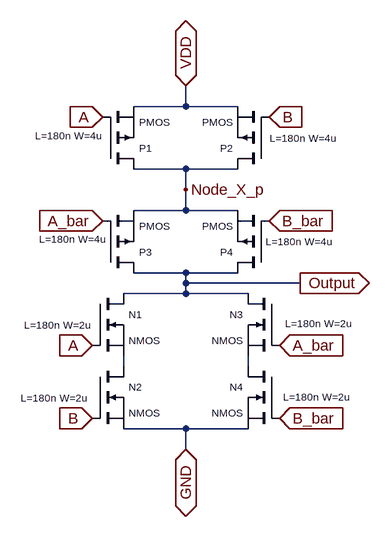
[diagram p0: schematic CMOS_XOR.asc]
CMOS_XOR.asc, the LTspice schematic file:
Version 4.1
SHEET 1 880 680
WIRE 208 -192 208 -224
WIRE 208 -192 128 -192
WIRE 288 -192 208 -192
WIRE 208 -96 128 -96
WIRE 288 -96 208 -96
WIRE 208 -64 208 -96
WIRE 208 -32 208 -64
WIRE 208 -32 128 -32
WIRE 288 -32 208 -32
WIRE 208 64 128 64
WIRE 288 64 208 64
WIRE 208 80 208 64
WIRE 384 80 208 80
WIRE 208 96 208 80
WIRE 208 96 112 96
WIRE 304 96 208 96
WIRE 112 208 112 192
WIRE 304 208 304 192
WIRE 208 304 112 304
WIRE 304 304 208 304
WIRE 208 336 208 304
FLAG 64 176 A
IOPIN 64 176 In
FLAG 64 288 B
IOPIN 64 288 In
FLAG 352 176 A_bar
IOPIN 352 176 In
FLAG 352 288 B_bar
IOPIN 352 288 In
FLAG 208 336 GND
IOPIN 208 336 BiDir
FLAG 208 -224 VDD
IOPIN 208 -224 BiDir
FLAG 384 80 Output
IOPIN 384 80 Out
FLAG 80 -176 A
IOPIN 80 -176 In
FLAG 80 -16 A_bar
IOPIN 80 -16 In
FLAG 336 -176 B
IOPIN 336 -176 In
FLAG 336 -16 B_bar
IOPIN 336 -16 In
FLAG 208 -64 Node_X_p
SYMBOL nmos 64 208 R0
WINDOW 0 56 32 Left 1
WINDOW 3 56 72 Left 1
WINDOW 123 -110 49 Left 1
SYMATTR InstName N2
SYMATTR Value2 L=180n W=2u
SYMBOL nmos 64 96 R0
WINDOW 0 56 32 Left 1
WINDOW 3 56 72 Left 1
WINDOW 123 -105 48 Left 1
SYMATTR InstName N1
SYMATTR Value2 L=180n W=2u
SYMBOL nmos 352 96 M0
WINDOW 0 56 32 Left 1
WINDOW 3 56 72 Left 1
WINDOW 123 -110 46 Left 1
SYMATTR InstName N3
SYMATTR Value2 L=180n W=2u
SYMBOL nmos 352 208 M0
WINDOW 0 56 32 Left 1
WINDOW 3 56 72 Left 1
WINDOW 123 -107 47 Left 1
SYMATTR InstName N4
SYMATTR Value2 L=180n W=2u
SYMBOL pmos 80 64 M180
WINDOW 0 56 32 Left 1
WINDOW 3 56 72 Left 1
WINDOW 123 251 48 Left 1
SYMATTR InstName P3
SYMATTR Value2 L=180n W=4u
SYMBOL pmos 336 64 R180
WINDOW 0 56 32 Left 1
WINDOW 3 56 72 Left 1
WINDOW 123 252 52 Left 1
SYMATTR InstName P4
SYMATTR Value2 L=180n W=4u
SYMBOL pmos 336 -96 R180
WINDOW 0 56 32 Left 1
WINDOW 3 56 72 Left 1
WINDOW 123 258 51 Left 1
SYMATTR InstName P2
SYMATTR Value2 L=180n W=4u
SYMBOL pmos 80 -96 M180
WINDOW 0 56 32 Left 1
WINDOW 3 56 72 Left 1
WINDOW 123 257 47 Left 1
SYMATTR InstName P1
SYMATTR Value2 L=180n W=4u

The netlist it stands for:
* CMOS_XOR.asc
M§N2 N001 B GND GND NMOS L=180n W=2u
M§N1 Output A N001 N001 NMOS L=180n W=2u
M§N3 Output A_bar N002 N002 NMOS L=180n W=2u
M§N4 N002 B_bar GND GND NMOS L=180n W=2u
M§P3 Output A_bar Node_X_p Node_X_p PMOS L=180n W=4u
M§P4 Output B_bar Node_X_p Node_X_p PMOS L=180n W=4u
M§P2 Node_X_p B VDD VDD PMOS L=180n W=4u
M§P1 Node_X_p A VDD VDD PMOS L=180n W=4u
.model NMOS NMOS
.model PMOS PMOS
.lib standard.mos
.backanno
.end